# EAGLE design schematic (EAGLE 5.11)
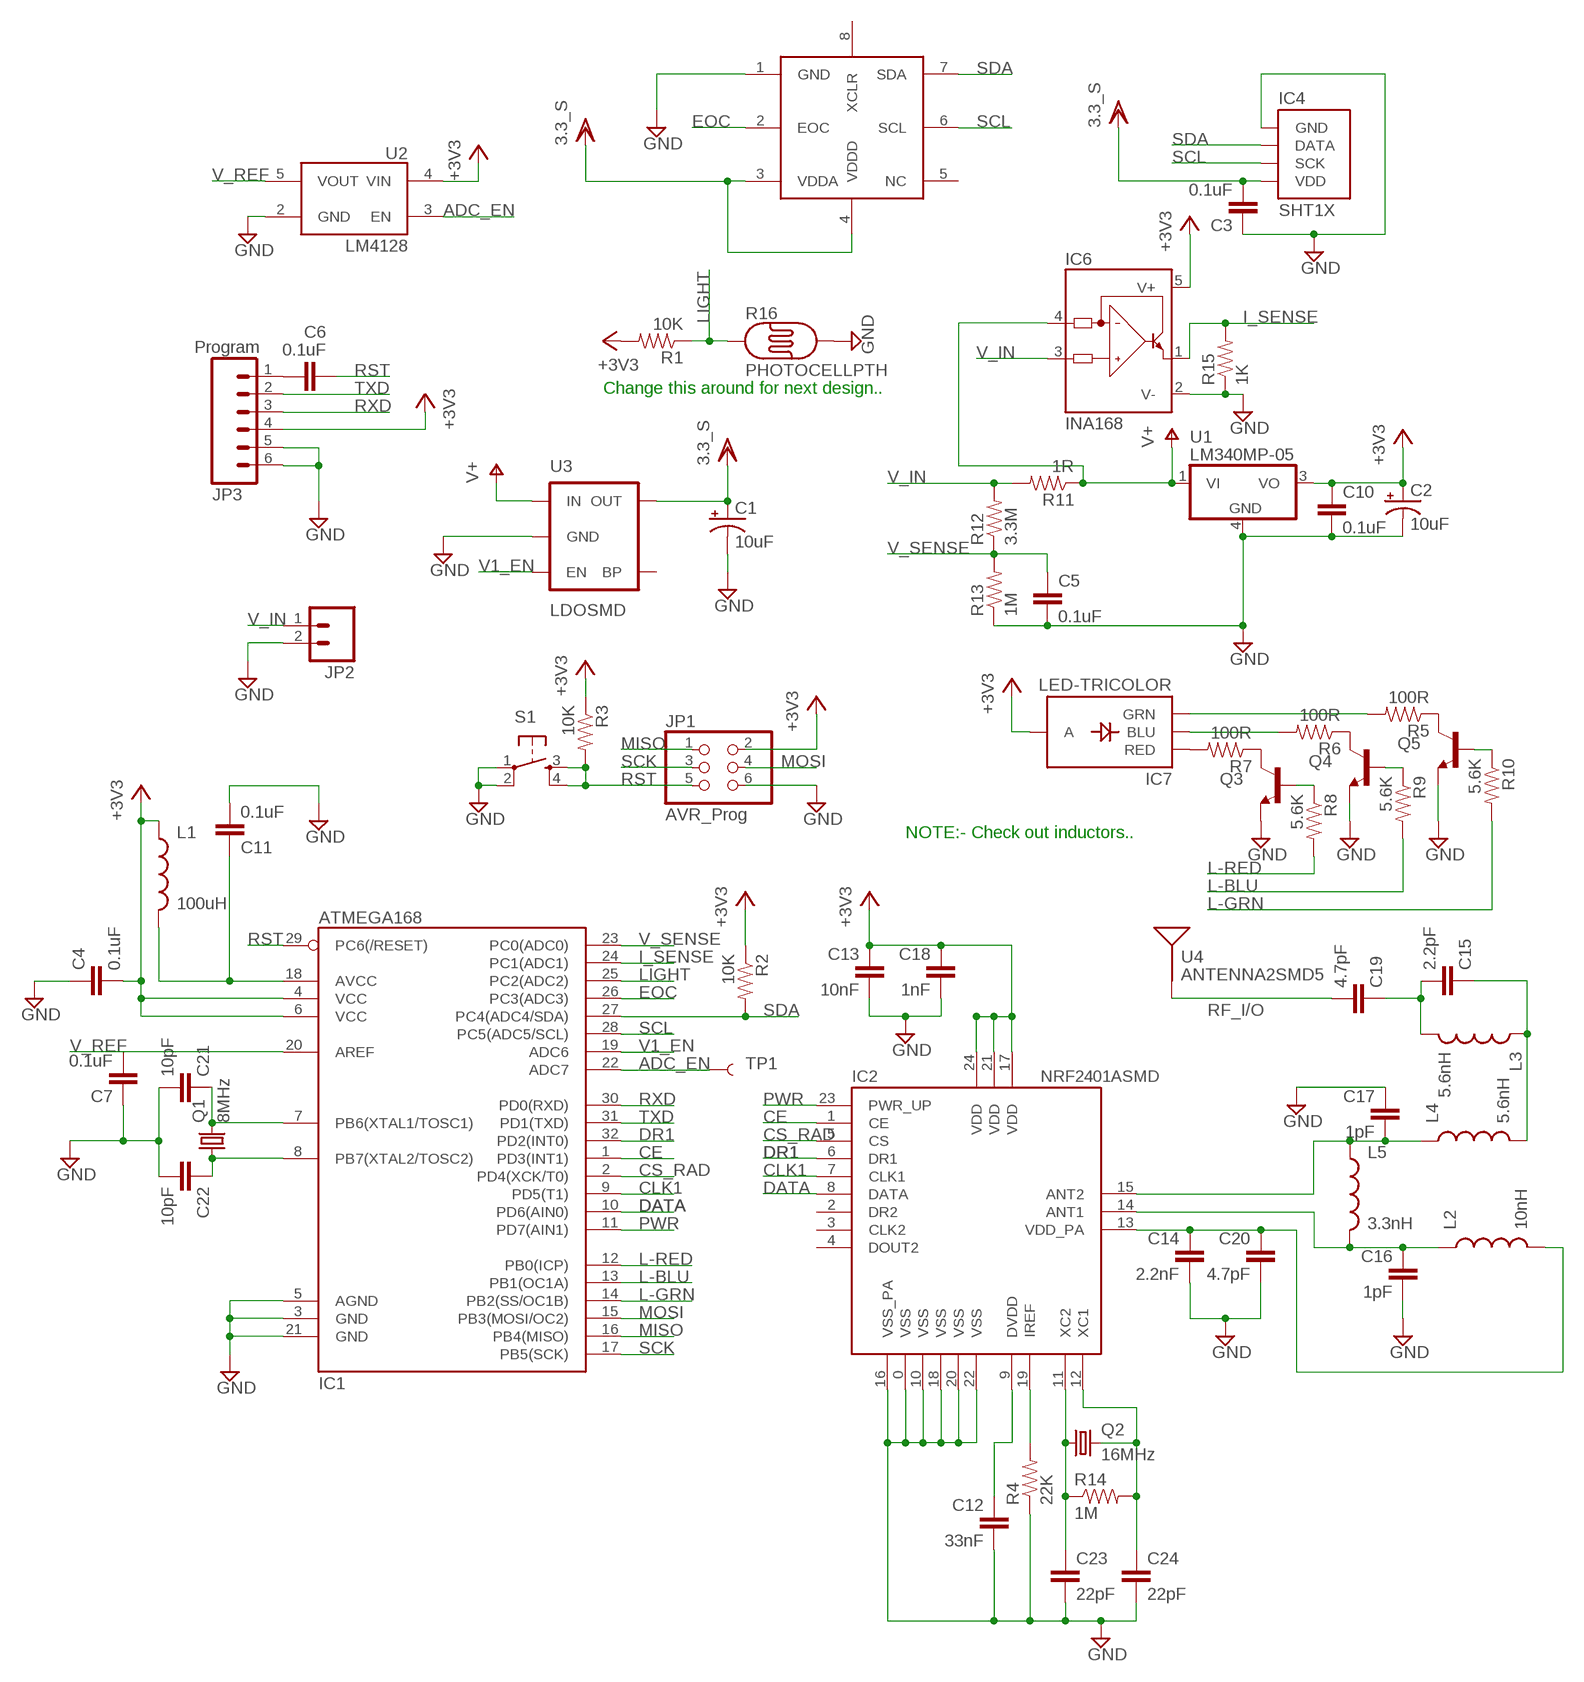
[diagram p0: schematic, sheet 1]

## Parts
C1  10uF  CAP_POL1206  [EIA3216]
C2  10uF  CAP_POL1206  [EIA3216]
C3  0.1uF  CAP0603-CAP  [0603-CAP]
C4  0.1uF  CAP0603-CAP  [0603-CAP]
C5  0.1uF  CAP0603-CAP  [0603-CAP]
C6  0.1uF  CAP0603-CAP  [0603-CAP]
C7  0.1uF  CAP0603-CAP  [0603-CAP]
C10  0.1uF  CAP0603-CAP  [0603-CAP]
C11  0.1uF  CAP0603-CAP  [0603-CAP]
C12  33nF  CAP0603-CAP  [0603-CAP]
C13  10nF  CAP0603-CAP  [0603-CAP]
C14  2.2nF  CAP0603-CAP  [0603-CAP]
C15  2.2pF  CAP0603-CAP  [0603-CAP]
C16  1pF  CAP0603-CAP  [0603-CAP]
C17  1pF  CAP0603-CAP  [0603-CAP]
C18  1nF  CAP0603-CAP  [0603-CAP]
C19  4.7pF  CAP0603-CAP  [0603-CAP]
C20  4.7pF  CAP0603-CAP  [0603-CAP]
C21  10pF  CAP0603-CAP  [0603-CAP]
C22  10pF  CAP0603-CAP  [0603-CAP]
C23  22pF  CAP0603-CAP  [0603-CAP]
C24  22pF  CAP0603-CAP  [0603-CAP]
IC1  ATMEGA168  [TQFP32-08]
IC2  NRF2401ASMD  [MLP-24]
IC4  SHT1X  SHT1XSMD  [SHT1X]
IC5  BMP085  [BMP085]
IC6  INA168  [SOT23-5]
IC7  LED-TRICOLOR  [LED-TRICOLOR-SMD]
JP1  AVR_Prog  PINHD-2X3  [2X03]
JP2  M023.5MM  [SCREWTERMINAL-3.5MM-2]
JP3  Program  M06SIP  [1X06]
L1  100uH  INDUCTOR1210  [1210]
L2  10nH  INDUCTOR0603  [0603]
L3  5.6nH  INDUCTOR0603  [0603]
L4  5.6nH  INDUCTOR0603  [0603]
L5  3.3nH  INDUCTOR0603  [0603]
Q1  8MHz  CRYSTAL5X3  [CRYSTAL-SMD-5X3]
Q2  16MHz  CRYSTAL5X3  [CRYSTAL-SMD-5X3]
Q3  TRANSISTOR_NPNSOT23  [SOT23]
Q4  TRANSISTOR_NPNSOT23  [SOT23]
Q5  TRANSISTOR_NPNSOT23  [SOT23]
R1  10K  RESISTOR1206  [1206]
R2  10K  RESISTOR1206  [1206]
R3  10K  RESISTOR1206  [1206]
R4  22K  RESISTOR1206  [1206]
R5  100R  RESISTOR1206  [1206]
R6  100R  RESISTOR1206  [1206]
R7  100R  RESISTOR1206  [1206]
R8  5.6K  RESISTOR1206  [1206]
R9  5.6K  RESISTOR1206  [1206]
R10  5.6K  RESISTOR1206  [1206]
R11  1R  RESISTOR1206  [1206]
R12  3.3M  RESISTOR1206  [1206]
R13  1M  RESISTOR1206  [1206]
R14  1M  RESISTOR1206  [1206]
R15  1K  RESISTOR1206  [1206]
R16  PHOTOCELLPTH  [PHOTOCELL]
S1  TAC_SWITCHSMD  [TACTILE_SWITCH_SMD]
TP1  TEST-POINT3X5  [PAD.03X.05]
U1  LM340MP-05  [SOT223]
U2  LM4128  LM4128-2.5VREF  [SOT23-5]
U3  LDOSMD  V_REG_LDOSMD  [SOT23-5]
U4  ANTENNA2SMD5  [ANTENNA-CHIP5]

## Nets
+3V3: C2.A(+) C4.2 C10.1 C13.1 C18.1 IC1.4(VCC) IC1.6(VCC) IC2.17(VDD) IC2.21(VDD) IC2.24(VDD) IC6.5(V+) IC7.A JP1.2 JP3.4 L1.1 R1.2 R2.1 R3.1 U1.3(VO) U2.4(VIN)
ADC_EN: IC1.22(ADC7) TP1.P$1 U2.3(EN)
CE: IC1.1(PD3(INT1)) IC2.1(CE)
CLK1: IC1.9(PD5(T1)) IC2.7(CLK1)
CS_RAD: IC1.2(PD4(XCK/T0)) IC2.5(CS)
DATA: IC1.10(PD6(AIN0)) IC2.8(DATA)
DR1: IC1.32(PD2(INT0)) IC2.6(DR1)
EOC: IC1.26(PC3(ADC3)) IC5.2(EOC)
GND: C1.C(-) C2.C(-) C3.1 C4.1 C5.2 C7.1 C10.2 C11.2 C12.2 C13.2 C14.2 C16.2 C17.1 C18.2 C20.2 C21.2 C22.2 C23.2 C24.2 IC1.3(GND) IC1.5(AGND) IC1.21(GND) IC2.0(VSS) IC2.10(VSS) IC2.16(VSS_PA) IC2.18(VSS) IC2.20(VSS) IC2.22(VSS) IC4.1(GND) IC5.1(GND) IC6.2(V-) JP1.6 JP2.2 JP3.5 JP3.6 Q3.2(E) Q4.2(E) Q5.2(E) R4.1 R13.1 R15.1 R16.2 S1.1 S1.2 U1.4(GND) U2.2(GND) U3.2(GND)
I_SENSE: IC1.24(PC1(ADC1)) IC6.1(OUT) R15.2
L-BLU: IC1.13(PB1(OC1A)) R9.2
L-GRN: IC1.14(PB2(SS/OC1B)) R10.2
L-RED: IC1.12(PB0(ICP)) R8.2
LIGHT: IC1.25(PC2(ADC2)) R1.1 R16.1
MISO: IC1.16(PB4(MISO)) JP1.1
MOSI: IC1.15(PB3(MOSI/OC2)) JP1.4
N$1: C14.1 C20.1 IC2.13(VDD_PA) L2.2
N$2: C6.2 JP3.1
N$3: C22.1 IC1.8(PB7(XTAL2/TOSC2)) Q1.1
N$4: C21.1 IC1.7(PB6(XTAL1/TOSC1)) Q1.3
N$5: C24.1 IC2.12(XC1) Q2.3 R14.2
N$6: C11.1 IC1.18(AVCC) L1.2
N$7: C16.1 IC2.14(ANT1) L2.1 L5.2
N$8: C23.1 IC2.11(XC2) Q2.1 R14.1
N$10: C17.2 IC2.15(ANT2) L4.1 L5.1
N$11: C12.1 IC2.9(DVDD)
N$12: IC2.19(IREF) R4.2
N$14: C15.1 L3.1 L4.2
N$15: C15.2 C19.1 L3.2
N$17: IC7.G(GRN) R5.2
N$18: Q5.3(C) R5.1
N$19: Q4.3(C) R6.1
N$20: IC7.R(RED) R7.2
N$21: Q3.3(C) R7.1
N$22: IC7.B(BLU) R6.2
N$23: Q3.1(B) R8.1
N$24: Q4.1(B) R9.1
N$25: Q5.1(B) R10.1
PWR: IC1.11(PD7(AIN1)) IC2.23(PWR_UP)
RF_I/O: C19.2 U4.FEED(SIGNAL)
RST: C6.1 IC1.29(PC6(/RESET)) JP1.5 R3.2 S1.3 S1.4
RXD: IC1.30(PD0(RXD)) JP3.3
SCK: IC1.17(PB5(SCK)) JP1.3
SCL: IC1.28(PC5(ADC5/SCL)) IC4.3(SCK) IC5.6(SCL)
SDA: IC1.27(PC4(ADC4/SDA)) IC4.2(DATA) IC5.7(SDA) R2.2
TXD: IC1.31(PD1(TXD)) JP3.2
V1_EN: IC1.19(ADC6) U3.3(EN)
V+: IC6.4(IN-) R11.1 U1.1(VI) U3.1(IN)
V_IN: IC6.3(IN+) JP2.1 R11.2 R12.2
V_REF: C7.2 IC1.20(AREF) U2.5(VOUT)
V_SENSE: C5.1 IC1.23(PC0(ADC0)) R12.1 R13.2
VDD: C1.A(+) C3.2 IC4.4(VDD) IC5.3(VDDA) IC5.4(VDDD) U3.5(OUT) ; supply symbol labelled 3.3_S
Unconnected: IC2.2(DR2) IC2.3(CLK2) IC2.4(DOUT2) IC5.5(NC) IC5.8(XCLR) U3.4(BP)

## Notes on the sheet
- Change this around for next design..
- NOTE:- Check out inductors..

## Library data of the parts
C1 C2 = SparkFun:CAP_POL: Capacitor Polarized These are standard SMD and PTH capacitors. Normally 10uF, 47uF, and 100uF in electrolytic and tantalum varieties. Always verify the external diameter of the through hole cap, it varies with capacity, voltage, and manufacturer. The EIA devices should be standard.
C3-C7 C10-C24 = SparkFun:CAP: Capacitor Standard 0603 ceramic capacitor, and 0.1" leaded capacitor.
IC1 = SparkFun:ATMEGA168
IC2 = SparkFun:NRF2401A: 2.4GHz Transceiver This is the very popular, low power RF transceiver from Nordic Semiconductor. Used in the Nike+iPod product. SKU: COM-00300
IC4 = SparkFun:SHT1X: SHT1x Humdity Sensor Sensirion humdity sensor. Schematic element and footprint proven. Spark Fun Electronics SKU : COM-08227
IC5 = SparkFun:BMP085
IC6 = burr-brown:INA168: High-Side Measurement Current Shunt Monitor; MF: TEXAS INSTRUMENTS; MPN: INA168NA/250; OC_FARNELL: 4375737; OC_NEWARK: 35C1744
IC7 = SparkFun:LED-TRICOLOR: Tri-Color LED SMD Proven layout and schematic for triple color LED in SMD package - common anode. Spark Fun Electronics SKU : COM-07844
JP1 = pinhead:PINHD-2X3: PIN HEADER
JP2 = SparkFun:M02: Header 2 Standard 2-pin 0.1" header. Use with straight break away headers (SKU : PRT-00116), right angle break away headers (PRT-00553), swiss pins (PRT-00743), machine pins (PRT-00117), and female headers (PRT-00115). Molex polarized connector foot print use with SKU : PRT-08233 with associated crimp pins and housings.
JP3 = SparkFun:M06: Header 6 Standard 6-pin 0.1" header. Use with straight break away headers (SKU : PRT-00116), right angle break away headers (PRT-00553), swiss pins (PRT-00743), machine pins (PRT-00117), and female headers (PRT-00115). Molex polarized connector foot print use with SKU : PRT-08094 with associated crimp pins and housings. NOTES ON THE VARIANTS LOCK and LOCK_LONGPADS... This footprint was designed to help hold the alignment of a through-hole component (i.e. 6-pin header) while soldering it into place. You may notice that each hole has been shifted either up or down by 0.005 of an inch from it's more standard position (which is a perfectly straight line). This slight alteration caused the pins (the squares in the middle) to touch the edges of the holes. Because they are alternating, it causes a "brace" to hold the component in place. 0.005 has proven to be the perfect amount of "off-center" position when using our standard breakaway headers. Although looks a little odd when you look at the bare footprint, once you have a header in there, the alteration is very hard to notice. Also, if you push a header all the way into place, it is covered up entirely on the bottom side. This idea of altering the position of holes to aid alignment will be further integrated into the Sparkfun Library for other footprints. It can help hold any component with 3 or more connection pins.
L1-L5 = SparkFun:INDUCTOR: Inductors Basic Inductor/Choke - 0603 and 1206. Footprints are not proven and vary greatly between part numbers.
Q1 Q2 = SparkFun:CRYSTAL: Crystals Various standard crystals. Proven footprints. Spark Fun Electronics SKU : COM-00534
Q3-Q5 = SparkFun:TRANSISTOR_NPN: Transistor NPN BJT configuration in SOT23 package. MMBT2222 is the common NPN we use. Double check BCE configuration again layout.
R1-R15 = SparkFun:RESISTOR: Resistor Basic schematic elements and footprints for 0603, 1206, and PTH 1/10th watt (small) resistors.
R16 = SparkFun:PHOTOCELL
S1 = SparkFun:TAC_SWITCH: Momentary Switch Button commonly used for reset or general input. Spark Fun Electronics SKU : COM-00097
TP1 = SparkFun:TEST-POINT
U1 = linear:LM340?-*: Positive VOLTAGE REGULATOR Source: http://cache.national.com/ds/LM/LM340.pdf
U2 = SparkFun:LM4128-2.5VREF
U3 = SparkFun:V_REG_LDO: Voltage Regulator LDO Standard 150mA LDO voltage regulator in SOT-23 layout. Micrel part MIC5205. BP (by-pass) pin is used to lower output noise with 470pF cap.
U4 = SparkFun:ANTENNA2: Antenna Single endded antenna. Common with smaller chip antennas. CHIP4 package is the GPS Chip Antenna SKU: GPS-08418. CHIP5 package is 2.4GHz chip antenna SKU: WRL-00144.

## Board
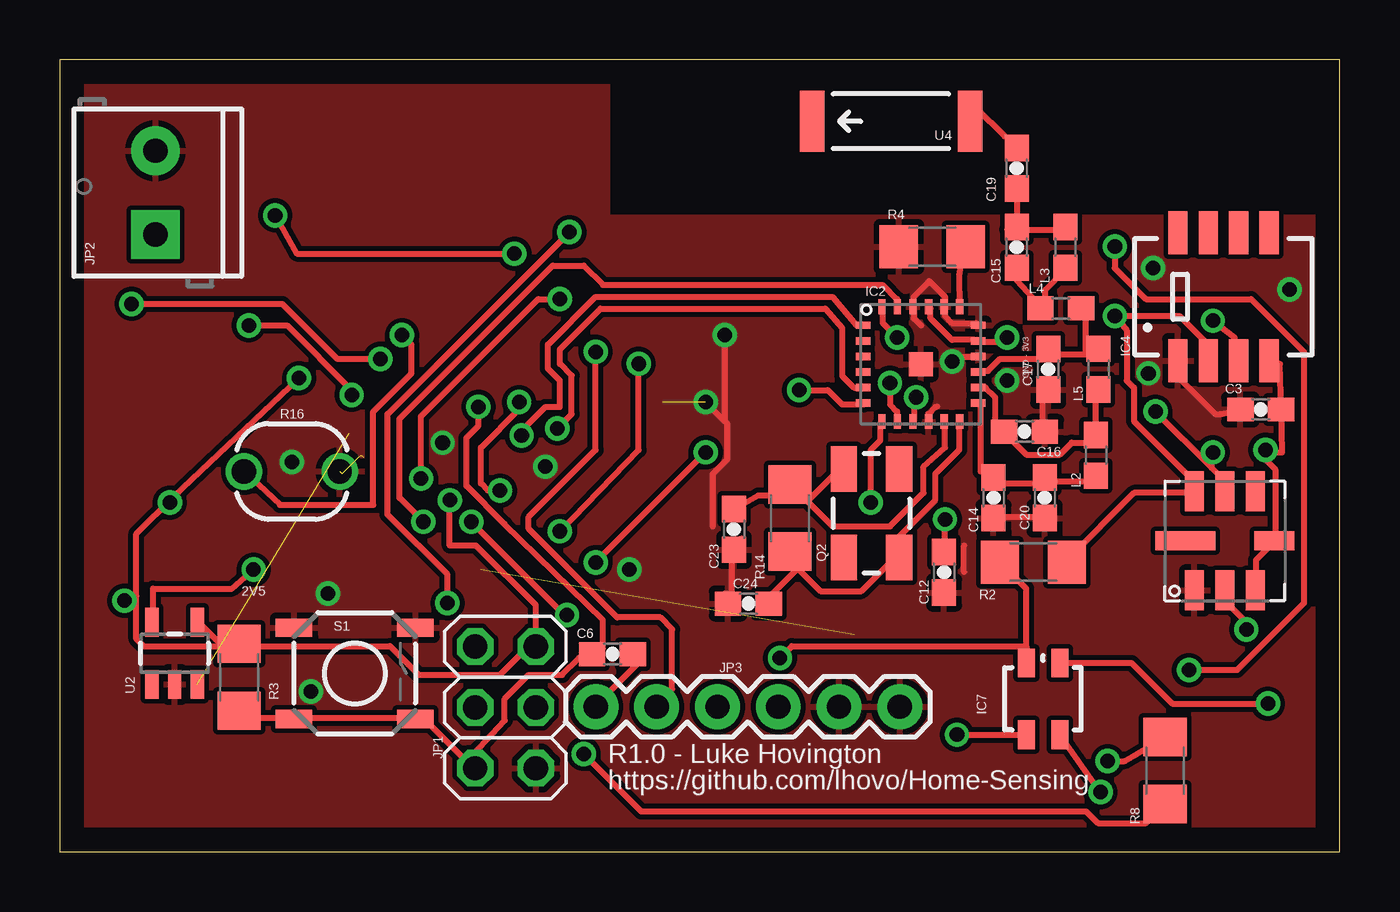
[diagram p1: board, top side]
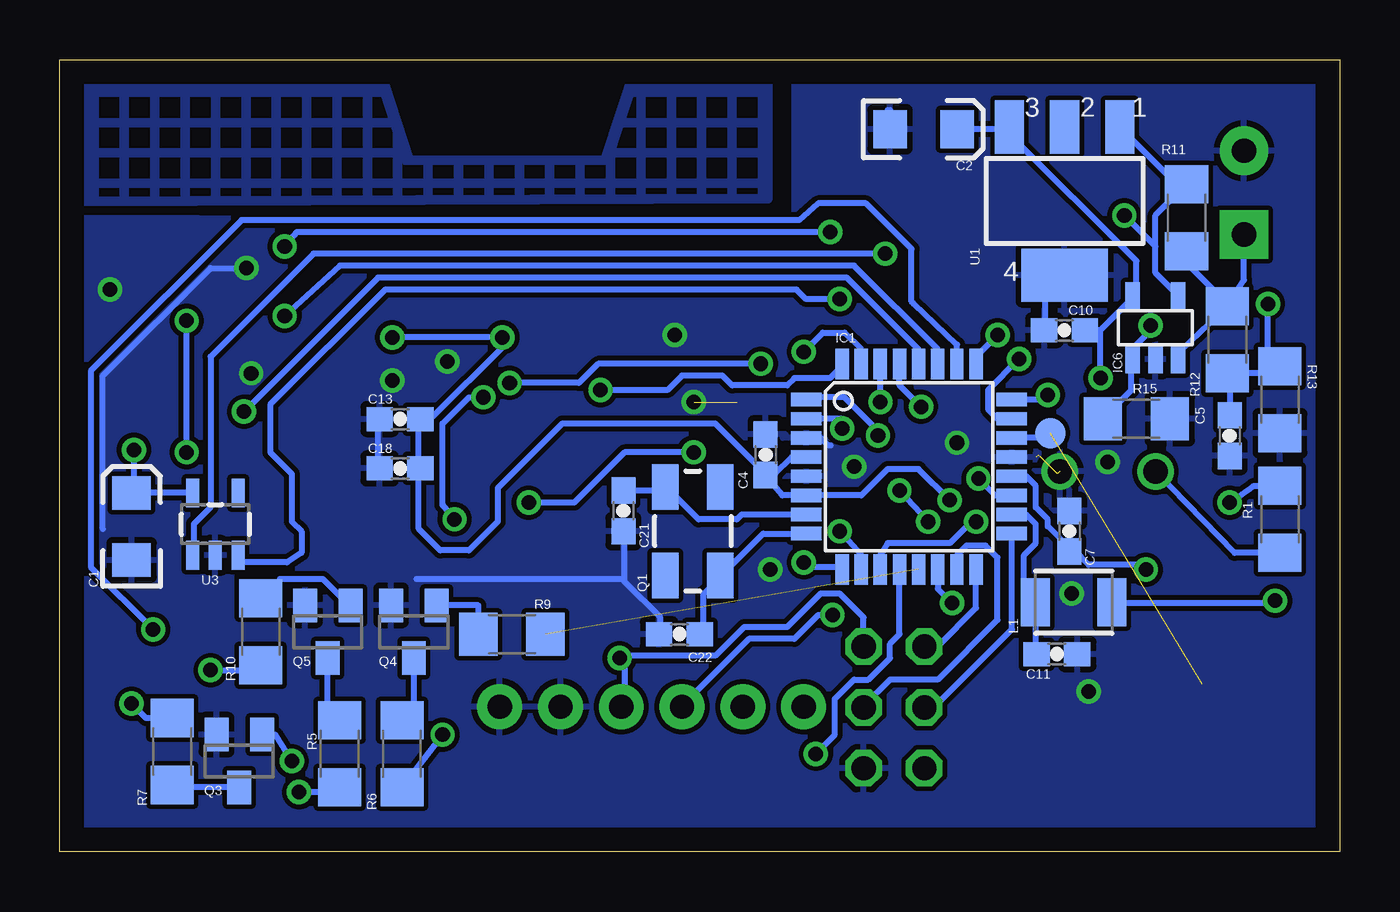
[diagram p2: board, bottom side, seen from below]

Size 53.5 x 33.1 mm. Coordinates in mm from the lower left corner, seen from the top.
Outline: 0,0 53.5,0 53.5,33.1 0,33.1 0,0
Copper layers (1*16): Top 0.035mm / dielectric 1.5mm / Bottom 0.035mm
Design rules "default": minimum track width 10mil, minimum drill 24mil, track to track 8mil, track to pad 8mil, pad to pad 8mil, via to via 8mil, smd to smd 8mil, copper to edge 40mil, drill to drill 8mil, minimum pad ring 10mil, minimum via ring 8mil, stop-mask expansion 4mil, vias tented up to drill 0mil, thermal gap 10mil

### Footprints (pad centres in the part's own frame; a part is rotated, then mirrored left to right if it is on the bottom)
EIA3216 = smd 1.4 x 1.6: A 1.4,0; C -1.4,0
0603-CAP = smd 1.1 x 1: 1 -0.85,0; 2 0.85,0
TQFP32-08 = smd 1.27 x 0.559: 1 -4.293,2.8; 2 -4.293,2; 3 -4.293,1.2; 4 -4.293,0.4; 5 -4.293,-0.4; 6 -4.293,-1.2; 7 -4.293,-2; 8 -4.293,-2.8; 17 4.293,-2.8; 18 4.293,-2; 19 4.293,-1.2; 20 4.293,-0.4; 21 4.293,0.4; 22 4.293,1.2; 23 4.293,2; 24 4.293,2.8 | smd 0.559 x 1.27: 9 -2.8,-4.293; 10 -2,-4.293; 11 -1.2,-4.293; 12 -0.4,-4.293; 13 0.4,-4.293; 14 1.2,-4.293; 15 2,-4.293; 16 2.8,-4.293; 25 2.8,4.293; 26 2,4.293; 27 1.2,4.293; 28 0.4,4.293; 29 -0.4,4.293; 30 -1.2,4.293; 31 -2,4.293; 32 -2.8,4.293
MLP-24 = smd 1 x 1: 0 0,0 | smd 0.61 x 0.305: 1 -2.401,1.625; 2 -2.401,0.975; 3 -2.401,0.325; 4 -2.401,-0.325; 5 -2.401,-0.975; 6 -2.401,-1.625; 13 2.401,-1.625; 14 2.401,-0.975; 15 2.401,-0.325; 16 2.401,0.325; 17 2.401,0.975; 18 2.401,1.625 | smd 0.305 x 0.61: 7 -1.625,-2.401; 8 -0.975,-2.401; 9 -0.325,-2.401; 10 0.325,-2.401; 11 0.975,-2.401; 12 1.625,-2.401; 19 1.625,2.401; 20 0.975,2.401; 21 0.325,2.401; 22 -0.325,2.401; 23 -0.975,2.401; 24 -1.625,2.401
SHT1X = smd 1.8 x 0.8: 1 -2.667,1.905; 2 -2.667,0.635; 3 -2.667,-0.635; 4 -2.667,-1.905; 5 2.667,-1.905; 6 2.667,-0.635; 7 2.667,0.635; 8 2.667,1.905
BMP085 = smd 1.67 x 0.8: 1 -2.065,1.27; 2 -2.065,0; 3 -2.065,-1.27; 5 2.065,-1.27; 6 2.065,0; 7 2.065,1.27 | smd 0.8 x 1.67: 4 0,-2.065 | smd 0.8 x 2.5: 8 0,1.65
SOT23-5 = smd 0.6 x 1.2: 1 -0.95,-1.306; 2 0,-1.306; 3 0.95,-1.306; 4 0.95,1.306; 5 -0.95,1.306
LED-TRICOLOR-SMD = smd 0.7 x 1.2: A 0.7,-1.5; B 0.7,1.5; G -0.7,1.5; R -0.7,-1.5
2X03 = drill 1.016 octagon: 1 -2.54,-1.27; 2 -2.54,1.27; 3 0,-1.27; 4 0,1.27; 5 2.54,-1.27; 6 2.54,1.27
SCREWTERMINAL-3.5MM-2 = drill 1.016 pad 2.032 square: 1 0,0 | drill 1.016 pad 2.032 round: 2 3.5,0
1X06 = drill 1.016 pad 1.88 round: 1 0,0; 2 2.54,0; 3 5.08,0; 4 7.62,0; 5 10.16,0; 6 12.7,0
1210 = smd 1.2 x 2: 1 -1.6,0; 2 1.6,0
0603 = smd 1.1 x 1: 1 -0.85,0; 2 0.85,0
CRYSTAL-SMD-5X3 = smd 1.9 x 1.1: 1 -1.85,-1.15; 2 1.85,-1.15; 3 1.85,1.15; 4 -1.85,1.15
SOT23 = smd 1 x 1.4: 1 -0.95,-1.1; 2 0.95,-1.1; 3 0,1.1
1206 = smd 1.6 x 1.8: 1 -1.4,0; 2 1.4,0
PHOTOCELL = drill 1.016 round: 1 -2,0; 2 2,0
TACTILE_SWITCH_SMD = smd 1.524 x 0.762: 1 -2.54,1.905; 2 2.54,1.905; 3 -2.54,-1.905; 4 2.54,-1.905
PAD.03X.05 = smd 1.27 x 1.27: P$1 0,0
SOT223 = smd 1.219 x 2.235: 1 -2.311,-3.099; 2 0,-3.099; 3 2.311,-3.099 | smd 3.6 x 2.2: 4 0,3.099
SOT23-5' = smd 0.55 x 1.2: 1 -0.95,-1.3; 2 0,-1.3; 3 0.95,-1.3; 4 0.95,1.3; 5 -0.95,1.3
ANTENNA-CHIP5 = smd 1.016 x 2.54: FEED -3.302,0; NC 3.302,0

### Placement (x,y rotation side)
C1  50.5,13.6 90 bottom
C2  17.4,30.2 0 bottom
C3  50.2,18.49 0 top
C4  24,16.6 270 bottom
C5  4.6,17.4 270 bottom
C6  23.1,8.27 0 top
C7  11.3,13.4 270 bottom
C10  11.5,21.8 180 bottom
C11  11.82,8.27 0 bottom
C12  36.96,11.69 270 top
C13  39.28,18.09 180 bottom
C14  39.03,14.8 270 top
C15  40,25.26 90 top
C16  40.33,17.56 0 top
C17  41.32,20.17 90 top
C18  39.28,16.03 180 bottom
C19  40,28.57 90 top
C20  41.17,14.8 270 top
C21  29.94,14.25 270 bottom
C22  27.6,9.1 180 bottom
C23  28.18,13.48 270 top
C24  28.78,10.38 180 top
IC1  18,16.1 0 bottom
IC2  35.99,20.38 0 top
IC4  48.64,23.2 90 top
IC5  48.7,13 90 top
IC6  7.7,21.9 0 bottom
IC7  41.1,6.4 180 top
JP1  18.63,6.04 270 top
JP2  4,25.8 90 top
JP3  22.41,6.07 0 top
L1  11.12,10.43 180 bottom
L2  43.31,16.57 270 top
L3  42.04,25.26 90 top
L4  41.84,22.72 180 top
L5  43.41,20.18 270 top
Q1  27.04,13.41 90 bottom
Q2  33.93,14.15 270 top
Q3  46,3.8 180 bottom
Q4  38.7,9.2 180 bottom
Q5  42.3,9.2 180 bottom
R1  2.5,13.9 90 bottom
R2  40.7,12.11 0 top
R3  7.5,7.3 270 top
R4  36.47,25.29 0 top
R5  41.8,4.1 270 bottom
R6  39.2,4.1 270 bottom
R7  48.8,4.2 90 bottom
R8  46.2,3.4 270 top
R9  34.6,9.1 0 bottom
R10  45.1,9.2 270 bottom
R11  6.4,26.5 270 bottom
R12  4.7,21.4 90 bottom
R13  2.5,18.9 90 bottom
R14  30.52,13.95 270 top
R15  8.5,18.1 180 bottom
R16  9.7,15.9 0 top
S1  12.33,7.46 0 top
TP1  12.1,17.5 0 bottom
U1  11.5,27.2 180 bottom
U2  LM4128  [SOT23-5']  4.8,8.3 0 top
U3  LDOSMD  [SOT23-5']  47,13.7 0 bottom
U4  34.75,30.53 180 top

### Tracks (layer width: path | path; a pad name or v marks a point on that pad's centre or on a via)
+3V3  (via drill 0.61)
  Top 0.254: IC2.17 38.3,21.4 | 40.4,8.6 IC7.A | 40.4,8.6 40.4,11 R2.1 | IC2.21 36.4,22.7 36.4,22.3 37.3,21.4 38.2,21.4 IC2.17 | v35,21.5 34.4,22.1 34.4,22.7 IC2.24 | v39.6,21.5 39.3,21.3 38.5,21.3 IC2.17 | 6.75,8.65 5.8,9.6 U2.4 | 6.75,8.65 7.1,8.3 R3.1 7.8,8.7 8.3,8.6 13.8,8.6 15,7.4 18.4,7.4 19.5,8.5 19.9,8.5 JP1.2 19.9,10.3 17.4,12.8 16.3,12.8 v16.3,14.7 | 4.75,14.85 3.2,13.3 3.2,10.7 | 4.75,14.85 v10,19.8 | 3.2,10.7 3.2,8.9 3.5,8.6 6.7,8.6 6.75,8.65 | 3.2,10.7 v2.7,10.5 | 4.75,14.85 v4.6,14.6 | v30.1,8.1 30.6,8.6 40.4,8.6
  Bottom 0.254: C4.2 23.3,14.9 IC1.6 20,14.9 18.9,16 17.6,16 v16.3,14.7 | C4.2 24,15.8 | C2.A 14.1,30.2 13.9,30.1 U1.3 13.8,30 8.5,24.7 8.5,23.3 IC6.5 8.7,23.1 10,21.8 | C13.1 38.5,18.1 | C13.1 38.4,18.2 37.9,18.2 35,21.1 v35,21.5 v39.6,21.5 | 9.6,10.5 L1.1 9.4,10.4 2.8,10.4 v2.7,10.5 | 10,21.8 C10.1 | v10,19.8 10,21.8 | R1.2 3.6,15.3 v4.6,14.6 | C13.1 38.5,18 38.5,16.1 C18.1 38.5,16 38.5,13.5 37.6,12.6 36.4,12.6 35.2,13.8 35.2,15.2 32.5,17.9 26.1,17.9 24.2,16 C4.2 | IC1.4 22.9,16.5 23.6,15.8 C4.2 | JP3.4 30,6.1 | JP3.4 29.9,6.1 | JP3.4 29.9,6.2 29.9,7.9 v30.1,8.1 29.9,8.2 26.1,8.2 24.9,9.4 23.1,9.4 21.7,10.8 20.9,10.8 19.9,9.8 JP1.2
ADC_EN  (1 unrouted)
  Bottom 0.254: 12.5,17.3 12.3,17.5 TP1.P$1 12.6,17.3 IC1.22
CE  (via drill 0.61)
  Top 0.254: v19.3,17.4 19.2,17.5 20.3,18.6 20.9,18.6 20.9,19.7 20.4,20.2 20.4,21.2 22.4,23.2 32.3,23.2 33.3,22 IC2.1
  Bottom 0.254: v19.3,17.4 19.2,17.5 20.7,19 22.1,19 22.2,18.9 IC1.1
CLK1  (via drill 0.61)
  Top 0.254: v33.9,14.6 33.9,16.8 34.3,17.2 34.3,17.9 IC2.7 | v22.4,12.1 v27,16.7
  Bottom 0.254: v33.9,14.6 32,14.6 29.9,16.7 v27,16.7 | v22.4,12.1 22.2,11.9 20.8,11.9 IC1.9
CS_RAD  (via drill 0.61)
  Top 0.254: v20.8,17.7 21.4,18.3 21.4,19.9 20.9,20.4 20.9,21 22.6,22.7 32,22.7 32.7,21.9 32.7,19.9 33.2,19.4 33.5,19.4 IC2.5
  Bottom 0.254: IC1.2 20.8,18.1 v20.8,17.7
DATA  (via drill 0.61)
  Top 0.254: v34.7,19.6 34.7,18.7 35,18.4 35,18 IC2.8 | v24.2,20.4 24.2,16.8 v20.9,13.4
  Bottom 0.254: v34.7,19.6 31.8,19.6 31,20.4 v24.2,20.4 | v20.9,13.4 20,12.4 IC1.10
DR1  (via drill 0.61)
  Top 0.254: v30.9,19.3 32.1,19.3 32.7,18.7 33.6,18.7 IC2.6
  Bottom 0.254: v30.9,19.3 28.1,19.3 27.5,19.9 25.8,19.9 25.4,19.5 23.1,19.5 22.8,19.8 21.3,19.8 20.8,20.3 IC1.32
EOC  (via drill 0.61)
  Top 0.254: v49.6,9.3 49.6,9.6 48.7,10.5 IC5.2
  Bottom 0.254: v49.6,9.3 52.2,11.9 52.2,20.1 45.9,26.4 22.6,26.4 21.8,27.1 19.8,27.1 17.9,25.2 17.9,23 17.8,22.9 16,21.2 IC1.26
GND  (via drill 0.61)  (5 unrouted)
  Top 0.254: 46.7,19.9 46.7,20.5 IC4.1 | 28.1,12.7 28.5,13.1 C23.2 | IC2.22 35.7,22.8 | R4.1 35.1,24.8 | R4.1 35.2,24.9 | IC2.18 38.3,22.1 37.3,22.1 37,22.4 37,22.7 IC2.20 37,22.8 37,23.2 36.35,23.85 35.7,23.2 35.7,22.9 IC2.22 | 38.5,20.7 IC2.16 38.3,20.7 37.3,20.7 v37.3,20.5 | R4.1 35,25 | C20.2 41.1,14 39.1,14 C14.2 39,13.9 | 37.8,11.7 37.8,12.8 | C12.2 37,10.9 | IC4.1 46.7,19.8 | C3.1 48.5,18.3 48.3,18.3 46.8,19.8 IC4.1 | C16.2 41.1,17.5 41.1,19 C17.1 41,19 | IC2.0 36,20.3 | 36,22 35.7,22.3 35.7,22.7 IC2.22 | IC2.0 36,20.5 | C24.2 28.1,10.8 28.1,12.6 C23.2 | C24.2 28.1,10.7 | C24.2 27.9,10.8 | C24.2 27.8,10.8 | 36,20.2 IC2.0 | IC2.0 36.1,20.7 | C24.2 28,10.3 | 27.3,13.6 27.3,15.8 27.9,16.4 27.9,17.9 27.75,18.05 | 27.75,18.05 v27,18.8 | C23.2 28.1,12.8 | R4.1 35.3,24.9 | v27.8,21.6 27.8,18.1 27.75,18.05 | IC2.10 36.3,18.1 36.3,18.3 36.6,18.6 36.68,18.61 | U2.2
  Bottom 0.254: 18.9,31 C2.C 18.8,31 | R15.1 7.2,18.5 | 29.9,11.4 29.9,13.4 C21.2 | 29.9,11.4 29.9,11.3 28.4,9.8 28.4,9.1 C22.2 | 29.9,11.4 38.6,11.4 | Q4.2 39.6,10.4 | C13.2 40.2,18 40.2,16.5 C18.2 | C13.2 40.2,18.2 | v37.3,20.5 37.7,20.5 | C13.2 40.1,18.1 | v45.7,24.4 47.2,24.4 51.7,19.9 51.7,13.5 | C1.C 50.5,12.3 | 24,17.6 C4.1 24.1,17.7 | C10.2 12.3,21.8 12.3,23.2 11.5,24 U1.4 | 11,7.9 11,8.2 C11.2 | IC1.3 21.7,17.3 21.4,17 21.27,16.99
  other vias: 39.6,19.7 23.8,11.8 16,17.1 9.7,16.3 51.4,23.5 11.2,10.8 20.3,16.1 45.5,20 10.5,6.7
  pour Top: 0.2,32.9 0.2,0.2 53.2,0.5 53.2,26.5 22.9,26.5 22.9,32.8
  pour Bottom: 0.2,32.9 0.2,0.2 53.2,0.5 53.2,26.5 47.7,26.5 22.8,26.2 22.8,32.8
I_SENSE  (via drill 0.61)
  Top 0.254: v12.2,19.1 12.2,19.3 9.5,22 v7.9,22
  Bottom 0.254: R15.2 8.7,19.3 8.7,20.5 IC6.1 8.6,20.7 8.6,21.1 7.9,21.8 v7.9,22 | v12.2,19.1 12.4,18.9 IC1.24
L-BLU  (1 unrouted)
L-GRN  (via drill 0.61)
  Top 0.254: v16.2,10.4 16.2,11.6 13.7,14.1 13.7,18.3 v21.3,25.9 | v44.1,25.3 44.1,24.4 45.4,23.1 49.8,23.1 52,20.9 52,10.4 49.2,7.6 v47.2,7.6
  Bottom 0.254: v16.2,10.4 16.8,11 IC1.14 | v21.3,25.9 43.6,25.9 v44.1,25.3 | v47.2,7.6 45.4,7.6 R10.2
L-RED  (via drill 0.61)
  Top 0.254: v21.9,4.1 24.3,1.7 42.9,1.7 43.4,1.2 45.4,1.2 R8.2
  Bottom 0.254: v21.9,4.1 21.1,4.9 21.1,6.4 20.3,7.2 19.7,7.2 18.8,8.1 18.8,8.7 18.4,9.1 IC1.12
LIGHT  (via drill 0.61)
  Top 0.254: v14.3,21.6 14.7,21.2 14.7,20 13.1,18.4 13.1,14.5 9.2,14.5 R16.1
  Bottom 0.254: R1.1 4.4,12.5 R16.1 | v14.3,21.6 15.2,20.7 IC1.25
MISO
  Bottom 0.254: IC1.16 15.2,10.2 16.8,8.6 17.3,8.6 JP1.1
MOSI
  Bottom 0.254: IC1.15 16,12.4 15.6,12.8 14.8,12.8 14.3,12.3 14.3,9.7 16.8,7.2 18.8,7.2 19.9,6.1 JP1.4
N$1
  Top 0.254: 38.5,15.9 38.5,18.7 IC2.13 | 38.5,15.9 C14.1 39,15.9 38.7,15.9 | L2.2 43.3,15.5 41.1,15.5 40.8,15.8 C20.1 41.1,15.4 39.2,15.4 38.7,15.9 | 38.5,15.9 38.7,15.9
N$2
  Top 0.254: C6.2 24.2,8.4 24.2,7.9 22.4,6.1 JP3.1
N$3
  Bottom 0.254: C22.1 26.6,9.1 26.6,10.8 25.9,11.5 Q1.1 25.8,11.6 24.1,13.3 IC1.8
N$4
  Bottom 0.254: C21.1 28.3,15.1 28.2,15.2 Q1.3 28.1,15.2 26.8,13.9 25.2,13.9 25,14.1 IC1.7
N$5
  Top 0.254: R14.2 30.5,12.5 | IC2.12 37.6,17.9 37.6,16.8 36.6,15.8 36.6,14.7 34.9,13 34.9,12.2 Q2.3 34.8,12.2 33.5,10.9 31.8,10.9 30.4,12.3 R14.2 | C24.1 29.8,10.8 30.8,11.8 R14.2
N$6
  Bottom 0.254: C11.1 12.7,8.3 12.7,10.4 L1.2 12.7,10.5 13.2,11 13.2,12.4 12.7,12.9 12.7,13.7 13.1,14.1 IC1.18
N$7
  Top 0.254: L2.1 43.3,17.2 | L5.2 43.3,19.2 43.3,17.3 L2.1 | IC2.14 38.7,19.4 39.1,19 39.1,17.7 39.3,17.5 C16.1 39.5,17.5 40.4,16.6 41.8,16.6 42.3,17.1 43.2,17.1 L2.1
N$8
  Top 0.254: IC2.11 37,18 37,16.9 36.1,16.1 36.1,15 34.7,13.6 32.3,13.6 30.6,15.3 R14.1 | C23.1 29.2,14.9 30.9,14.9 R14.1 | Q2.1 32.5,15.9 31.3,14.7 R14.1
N$9
  pour Bottom (hatched): 23.9,27.3 47.8,27.2 53.1,27.2 53.1,32.8 40.2,32.9 38.9,28.9 30.7,28.9 29.4,32.9 23.9,32.9
N$10
  Top 0.254: IC2.15 38.4,20.1 38.8,20.1 39.3,20.6 41.3,20.6 C17.2 41.3,20.8 43.3,20.8 L5.1 42.9,20.9 42.9,22.5 L4.1
N$11  (via drill 0.61)
  Top 0.254: v35.8,19 35.7,18.9 35.7,18 IC2.9 | v37,13.9 37,12.6 C12.1
  Bottom 0.254: v35.8,19 36.4,19 37.5,17.9 37.5,14.5 v37,13.9
N$12
  Top 0.254: IC2.19 37.6,24.1 37.7,24.7 37.8,24.8 R4.2
N$14
  Top 0.254: L3.1 42,24.3 41.2,23.5 41.2,22.5 L4.2 41.1,22.7 40,23.9 C15.1
N$15
  Top 0.254: C19.1 C15.2 39.6,26 42,26 L3.2
N$17  (via drill 0.61)
  Top 0.254: v43.5,2.5 IC7.G
  Bottom 0.254: v43.5,2.5 41.9,2.5 R5.2
N$18
  Bottom 0.254: Q5.3 42.3,5.9 R5.1
N$19
  Bottom 0.254: Q4.3 38.7,5.9 R6.1
N$20  (via drill 0.61)
  Top 0.254: IC7.R 44.8,7.9 46.5,6.2 v50.5,6.2
  Bottom 0.254: v50.5,6.2 49.9,5.6 R7.2
N$21
  Bottom 0.254: Q3.3 48.7,2.7 R7.1
N$22  (via drill 0.61)
  Top 0.254: v37.5,4.9 IC7.B
  Bottom 0.254: v37.5,4.9 R6.2
N$23  (via drill 0.61)
  Top 0.254: v43.8,3.8 44.5,3.8 R8.1
  Bottom 0.254: v43.8,3.8 44.5,4.9 Q3.1
N$24
  Bottom 0.254: R9.1 36,10.3 Q4.1
N$25
  Bottom 0.254: R10.1 44.3,11.4 42.5,11.4 41.4,10.3 Q5.1
PWR  (via drill 0.61)
  Top 0.254: v15.2,13.8 14.2,14.8 14.2,18.1 20.6,24.5 21.9,24.5 22.7,23.7 34.4,23.7 35,23.1 35,22.8 IC2.23
  Bottom 0.254: v15.2,13.8 15.4,13.8 16.3,12.9 18.9,12.9 19.2,12.4 IC1.11
RF_I/O
  Top 0.254: C19.2 39.5,29.9 38.3,31.1 U4.FEED
RST  (via drill 0.61)
  Top 0.254: v17.5,18.6 17.5,17.8 17,17.3 17,15.3 18.6,13.7 22.7,9.7 22.7,8.5 C6.1 22.4,8.1 21.7,8.1 21,7.4 19.6,7.4 18.6,6.4 18.6,5.5 17,3.8 | R3.2 7.8,5.6 9.7,5.6 S1.3 9.9,5.6 14.8,5.6 S1.4 14.9,5.5 15.3,5.5 17,3.8 | 17,3.8 17.3,3.5 JP1.5 17,3.8
  Bottom 0.254: v17.5,18.6 18.4,19.5 IC1.29
RXD  (via drill 0.61)
  Top 0.254: v21.2,9.9 21.1,9.9 v17.2,13.8 | v19.2,18.8 19.2,18.5 17.6,16.9 17.6,15.4 17.9,15.1 v18.4,15.1
  Bottom 0.254: v19.2,18.8 IC1.30 | v17.2,13.8 v18.4,15.1 | 27.4,6.1 JP3.3 27.3,6.1 27.3,6.3 24.7,8.9 22.8,8.9 21.8,9.9 v21.2,9.9
SCK
  Bottom 0.254: IC1.17 13.7,9.3 16.9,6.1 17.3,6.1 JP1.3
SCL  (via drill 0.61)
  Top 0.254: 48.15,16.05 48.7,15.5 IC5.6 | v45.8,18.4 48.15,16.05 | v48.2,22.2 49.1,21.5 49.1,20.6 IC4.3 | 48.15,16.05 v48.2,16.7
  Bottom 0.254: v45.8,18.4 40.2,24 20.6,24 17.6,21 IC1.28 | v48.2,16.7 v48.2,22.2
SDA  (via drill 0.61)
  Top 0.254: R2.2 42.1,12.2 44.9,15 47.4,15 IC5.7 47.2,15.29 47.2,15.7 44.9,18 44.9,19.4 44.6,19.7 44.6,21.8 v44.1,22.4 46.8,22.4 47.9,21.3 47.9,20.6 IC4.2
  Bottom 0.254: v44.1,22.4 41.8,24.5 20.3,24.5 16.8,21 IC1.27
TXD  (via drill 0.61)
  Top 0.254: v22.4,20.9 22.4,16.8 19.6,14 19.6,13.5 23.3,9.8 25.1,9.8 25.6,9.3 25.6,6.8 24.9,6.1 JP3.2
  Bottom 0.254: v22.4,20.9 21.6,21.7 20.7,21.7 20,21 IC1.31
V1_EN  (via drill 0.61)
  Top 0.254: v20.9,23.1 20,23.1 15.1,18.2 v15.1,15.6
  Bottom 0.254: v20.9,23.1 22.3,23.1 22.7,23.5 39.9,23.5 44.7,18.7 44.7,16.7 43.8,15.8 43.8,13.8 43.4,13.4 43.4,12.5 44,12.1 46,12.1 U3.3 | v15.1,15.6 14.4,14.9 IC1.19
V+  (via drill 0.61)
  Top 0.254: v19,25 9.9,25 v9,26.6
  Bottom 0.254: 7.7,25.3 7.7,26.6 6.6,27.7 | 7.7,25.3 7.7,24.2 6.8,23.3 IC6.4 | v19,25 42.9,25 47.2,20.7 47.2,14.4 47.9,13.7 47.9,12.4 U3.1 | 7.7,25.3 v9,26.6 | 6.6,27.7 9.1,30.2 U1.1 | 6.6,27.7 R11.1
V_IN
  Bottom 0.254: R12.2 6.6,21 6.6,20.6 IC6.3 | R11.2 6.4,24.6 4.7,22.9 R12.2 | JP2.1 4,23.9 R12.2
V_REF  (via drill 0.61)
  Top 0.254: v8.1,11.8 7.2,11 3.9,11 3.9,9.7 U2.5
  Bottom 0.254: 11.25,12.65 11.2,12.6 | 11.25,12.65 12.2,13.6 12.2,13.9 12.7,14.4 12.7,15.3 13.1,15.7 IC1.20 | 11.25,12.65 11.3,12.6 C7.2 11.1,12.6 10.5,12 8.4,12 v8.1,11.8
V_SENSE  (via drill 0.61)
  Top 0.254: v13.4,20.6 11.6,20.6 9.3,22.9 v3,22.9
  Bottom 0.254: R13.2 3,20 | 3,20 R12.1 4.6,19.9 C5.1 | v13.4,20.6 14.7,19.3 14.7,18.5 14.3,18.1 IC1.23 | 3,20 v3,22.9
VDD  (via drill 0.61)
  Top 0.254: IC4.4 50.4,20.5 50.3,20.4 51,20.4 C3.2 51.1,16.7 50.3,16.7 | 50.3,16.7 50.3,16.5 50.8,16 50.8,13.1 IC5.4 50.7,12.9 50,12.2 50,11 IC5.3 | v50.4,16.8 50.3,16.7
  Bottom 0.254: U3.5 48,15 C1.A 50.4,15.1 v50.4,16.8

### Text on the board
tNames: GND - 3V3 | 2V5 | R1.0 - Luke Hovington | https://github.com/lhovo/Home-Sensing